# EasyEDA Pro project 小张FOC-STM32G431CBU6.epro, board PCB3
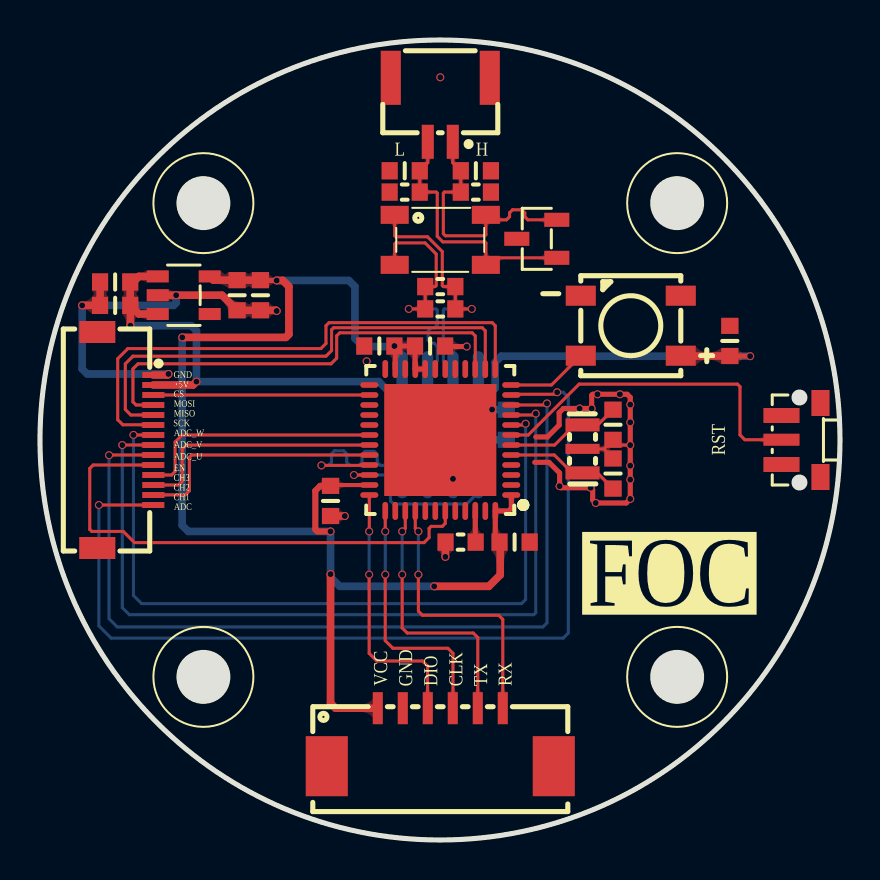
[diagram p7: board, top side]
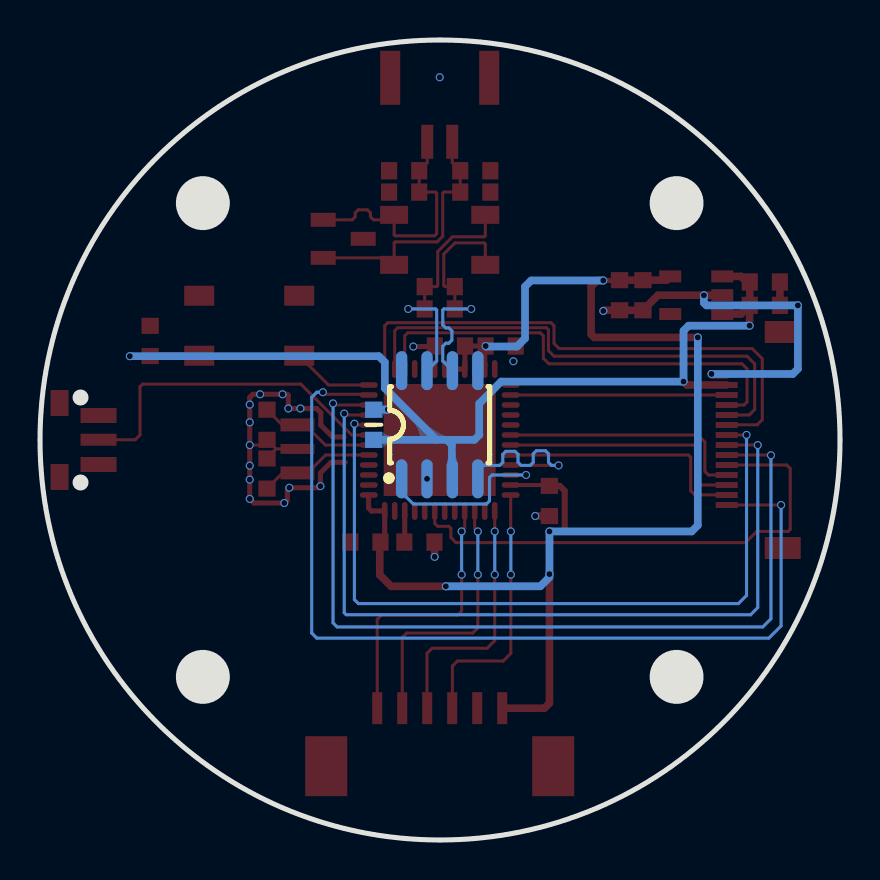
[diagram p8: board, bottom side, seen from below]

Outline 40 x 40 mm; copper layers: Top Layer, Bottom Layer. Coordinates in mm from the lower left corner of the outline.
Outline path: circle c20,20 r20
Stack: Top Layer 0.035mm - / Dielectric1 1.51mm FR4 er 4.5 / Bottom Layer 0.035mm -

## Design rules (mm)
net FDCAN_RX: DP3
net FDCAN_TX: DP3
net FDCAN_H: DP2
net FDCAN_L: DP2
net $1N5235: DP1
net $1N5225: DP1
template: 自定义配置
spacing copperThickness1oz (default): track to track 0.102, other pairs 0.102 to 0.127
spacing copperThickness2oz: track to track 0.203, other pairs 0.152 to 0.3
track width copperThickness1oz (default): min 0.127, default 0.152, max 2.54
track width copperThickness2oz: min 0.203, default 0.254, max 2.54
differential pair differentialPair (default): width min 0.127, default 0.152, max 2.54; gap min 0.152, default 0.152
via viaSize (default): diameter min 0.399, default 0.5, max 10; hole min 0.3, default 0.3, max 6.299

## Placement (name value [footprint] x y rotation side)
C1  100nF  [C0603_SMALL]  23.73 14.89 180 top
C2  100nF  [C0603_SMALL]  16.97 24.7 0 top
C3  100nF  [C0603_SMALL]  14.53 16.95 90 top
C4  100nF  [C0603_SMALL]  19.51 24.7 180 top
C6  20pF  [C0603_SMALL]  28.65 18.32 90 top
C7  20pF  [C0603_SMALL]  28.65 20.76 90 top
C8  100nF  [C0603_SMALL]  34.49 24.95 270 top
C9  100nF  [C0603_SMALL]  23.32 20.76 270 bottom
C10  1uF  [C0603_SMALL]  3.76 27.9 0 top
C11  100nF  [C0603_SMALL]  3.76 26.73 0 top
C12  1uF  [C0603_SMALL]  11.02 27.24 90 top
C13  100nF  [C0603_SMALL]  9.85 27.24 90 top
C14  33pF  [C0603_SMALL]  21.79 33.46 180 top
C15  33pF  [C0603_SMALL]  18.24 33.46 180 top
CN1  1.25-6P WT  [CONN-SMD_1.25-6PWT]  20.01 5.14 180 top
CN2  X1251WRS-02HF-LPSW  [CONN-SMD_2P-P1.25_X1251WRS-02HF-LPSW]  20.01 36.51 180 top
D1  PESD2CAN  [SOT-23-3_L2.9-W1.3-P1.90-LS2.4-BR]  24.84 30.06 0 top
FPC1  FPC-05F-14PH15  [FPC-SMD_14P-P0.50_XUNPU_FPC-05F-14PH15]  4.27 20 270 top
L1  ACT45B-510-2P-TL003  [IND-SMD_4P-L4.5-W3.2-TL]  20.01 30.01 0 top
LED1  XL-5050RGBC-WS2812B  [LED-SMD_4P-L5.0-W5.0-BL_XL-5050RGBC]  29.54 25.72 90 top
R2  62R  [R0603_SMALL]  20.01 26.55 0 top
R3  62R  [R0603_SMALL]  20.01 27.67 0 top
R4  1.5kΩ  [R0603_SMALL]  21.79 32.39 180 top
R5  1.5kΩ  [R0603_SMALL]  18.24 32.39 180 top
R6  10K  [R0603_SMALL]  21.03 14.89 0 top
SW1  SKRTLAE010  [KEY-SMD_SKRTLAE010]  38.05 20 90 top
TP1  M2.5螺丝孔  [X-M2.5螺丝孔]  31.86 31.84 0 top
TP2  M2.5螺丝孔  [X-M2.5螺丝孔]  8.17 8.16 0 top
TP3  M2.5螺丝孔  [X-M2.5螺丝孔]  8.17 31.84 0 top
TP4  M2.5螺丝孔  [X-M2.5螺丝孔]  31.86 8.16 0 top
U1  STM32G431CBU6U  [UFQFPN-48_L7.0-W7.0-P0.50-BL-EP5.6]  20.01 20 90 top
U2  TJA1050T/CM,118  [SOIC-8_L5.0-W4.0-P1.27-LS6.0-BL]  20.01 20.76 180 bottom
U3  RT9013-3.3GB  [SOT-23-5_L2.9-W1.6-P0.94-LS2.8-BL]  7.19 27.24 270 top
X1  8MHz  [OSC-SMD_3P-L3.2-W1.3-P1.2-L]  27.13 19.56 90 top

## Footprints (pads in the part's own frame, mm; a bottom-side part is the same pattern mirrored in y, then rotated)
C0603_SMALL
  rect 0.806x0.864 smd: 1(-0.753,0) 2(0.753,0)
CONN-SMD_1.25-6PWT
  rect 0.5x1.6 smd: 1(3.125,-1.45) 2(1.875,-1.45) 3(0.625,-1.45) 4(-0.625,-1.45) 5(-1.875,-1.45) 6(-3.125,-1.45)
  rect 2.1x3 smd: 7(-5.675,1.45) 8(5.675,1.45)
CONN-SMD_2P-P1.25_X1251WRS-02HF-LPSW
  rect 0.6x1.7 smd: 1(-0.625,1.6) 2(0.625,1.6)
  rect 1x2.7 smd: 3(2.475,-1.6) 4(-2.475,-1.6)
FPC-SMD_14P-P0.50_XUNPU_FPC-05F-14PH15
  rect 0.3x1.1 smd: 1(-3.25,1.4) 2(-2.75,1.4) 3(-2.25,1.4) 4(-1.75,1.4) 5(-1.25,1.4) 6(-0.75,1.4) 7(-0.25,1.4) 8(0.25,1.4) 9(0.75,1.4) 10(1.25,1.4) 11(1.75,1.4) 12(2.25,1.4) 13(2.75,1.4) 14(3.25,1.4)
  rect 1.1x1.8 smd: 15(5.4,-1.4) 16(-5.4,-1.4)
IND-SMD_4P-L4.5-W3.2-TL
  rect 1.4x0.9 smd: 1(-2.28,1.25) 2(-2.28,-1.25) 3(2.28,-1.25) 4(2.28,1.25)
KEY-SMD_SKRTLAE010
  rect 0.75x1.8 smd: 1(-1.225,0.975) 3(1.225,0.975)
  rect 0.6x1.8 smd: 2(0.015,0.975)
  rect 1.3x0.9 smd: 4(-1.85,-0.975) 5(1.85,-0.975)
LED-SMD_4P-L5.0-W5.0-BL_XL-5050RGBC
  rect 1x1.5 smd: 1(-1.5,-2.5) 2(1.5,-2.5) 3(1.5,2.5) 4(-1.5,2.5)
OSC-SMD_3P-L3.2-W1.3-P1.2-L
  rect 0.65x1.7 smd: 1(-1.2,0) 3(1.2,0)
  rect 0.5x1.7 smd: 2(0,0)
R0603_SMALL
  rect 0.806x0.864 smd: 1(-0.753,0) 2(0.753,0)
SOIC-8_L5.0-W4.0-P1.27-LS6.0-BL
  oval 0.569x1.95 smd: 1(-1.905,-2.705) 2(-0.635,-2.705) 3(0.635,-2.705) 4(1.905,-2.705) 5(1.905,2.705) 6(0.635,2.705) 7(-0.635,2.705) 8(-1.905,2.705)
SOT-23-3_L2.9-W1.3-P1.90-LS2.4-BR
  rect 1.25x0.7 smd: 1(1,-0.95) 2(1,0.95) 3(-1,0)
SOT-23-5_L2.9-W1.6-P0.94-LS2.8-BL
  rect 0.6x1.1 smd: 1(-0.94,-1.3) 2(0,-1.3) 3(0.94,-1.3) 4(0.94,1.3) 5(-0.94,1.3)
UFQFPN-48_L7.0-W7.0-P0.50-BL-EP5.6
  oval 0.28x0.9 smd: 1(-2.751,-3.547) 2(-2.251,-3.547) 3(-1.75,-3.547) 4(-1.25,-3.547) 5(-0.75,-3.547) 6(-0.249,-3.547) 7(0.249,-3.547) 8(0.75,-3.547) 9(1.25,-3.547) 10(1.75,-3.547) 11(2.251,-3.547) 12(2.751,-3.547) 25(2.751,3.547) 26(2.251,3.547) 27(1.75,3.547) 28(1.25,3.547) 29(0.75,3.547) 30(0.249,3.547) 31(-0.249,3.547) 32(-0.75,3.547) 33(-1.25,3.547) 34(-1.75,3.547) 35(-2.251,3.547) 36(-2.751,3.547)
  oval 0.9x0.28 smd: 13(3.547,-2.75) 14(3.547,-2.25) 15(3.547,-1.75) 16(3.547,-1.25) 17(3.547,-0.75) 18(3.547,-0.25) 19(3.547,0.25) 20(3.547,0.75) 21(3.547,1.25) 22(3.547,1.75) 23(3.547,2.25) 24(3.547,2.75) 37(-3.547,2.751) 38(-3.547,2.251) 39(-3.547,1.75) 40(-3.547,1.25) 41(-3.547,0.75) 42(-3.547,0.249) 43(-3.547,-0.249) 44(-3.547,-0.75) 45(-3.547,-1.25) 46(-3.547,-1.75) 47(-3.547,-2.251) 48(-3.547,-2.751)
  rect 5.6x5.6 smd: 49(0,0)

## Nets
As in the schematic.

Pads without a net: FPC1 15 16; LED1 2; U1 2 3 4 16 17 18 19 22 24 25 27 28 29 38 41 42 44 45 47; U2 5; U3 4

## Via types
v1: diameter 0.4, hole 0.3, Top Layer to Bottom Layer, 53 vias

## Routing (per net, layer and track width the routed paths; a pad name or vN(x,y) marks a point on that pad's centre or on a via; arc(x,y) is an arc through that point)
+5V: length 54.3
  Top Layer w0.254: v1(35.51,24.19) 34.5,24.19 C8.2
  Top Layer w0.381: 4.52,26.72 C11.2 4.51,27.75 4.94,28.18 U3.1 ; 4.52,26.72 v1(4.52,25.72) ; 4.52,26.72 4.94,26.3 U3.3 ; FPC1.2 7.65,22.75 v1(7.82,22.92) ; C8.2 32.06,24.2 LED1.1
  Bottom Layer w0.381: 20.18,20.01 22.76,22.59 22.76,23.89 23.06,24.19 v1(35.51,24.19) ; 20.18,20.01 19.67,20.01 ; 20.18,20.01 C9.2 ; 19.67,20.01 18.28,20.01 18.03,20.25 18.03,21.83 16.94,22.92 v1(7.82,22.92) 7.82,25.46 7.57,25.72 v1(4.52,25.72) ; 19.67,20.01 19.41,19.75 19.41,18.08 U2.3
GND: length 49.4
  Top Layer w0.152: 28.2,19.56 28.65,19.1 C6.2 ; 28.2,19.56 C7.1 28.91,19.75 v1(29.51,19.75) ; 28.2,19.56 X1.2
  Top Layer w0.254: v1(21.34,24.67) 20.28,24.67 C4.1 ; 24.74,18.88 25.45,18.88 25.98,18.35 v1(25.98,17.69) 26.06,17.61 v1(27.53,17.61) 27.63,17.51 27.63,17 v1(27.79,16.85) 29.31,16.85 v1(29.51,17.05) v1(29.51,18.02) v1(29.51,18.72) v1(29.51,19.75) v1(29.51,20.88) v1(29.51,21.77) 29.51,22.13 29.36,22.29 v1(29,22.29) v1(27.87,22.29) 27.63,22.29 27.58,22.23 v1(27.58,21.58) v1(26.98,21.58) 26.17,21.58 25.96,21.36 25.96,20.74 25.37,20.15 24.79,20.15
  Top Layer w0.381: U3.2 v1(6.81,27.24) 9.1,27.24 C13.1 11.8,26.49 v1(11.84,26.45) ; v1(22.61,21.52) 21.54,21.52 U1.49 ; v1(2.11,26.73) C11.1 3.01,27.75 ; R6.1 20.27,14.89 v1(20.27,14.16) ; v1(6.43,23.3) 6.37,23.25 FPC1.1 ; C3.1 v1(15.24,16.2)
  Bottom Layer w0.381: v1(6.81,27.24) 6.81,26.86 6.68,26.73 v1(2.11,26.73) 2.11,23.56 2.36,23.3 v1(6.43,23.3) ; C9.1 22.61,21.52 v1(22.61,21.52)
  vias: v1(16.33,23.94) v1(20.01,38.14) v1(20.65,18.06)
VCC: length 72
  Top Layer w0.203: U1.35 14.57,17.75 C3.2
  Top Layer w0.254: v1(11.84,27.98) 10.89,27.98 10.87,27.99 ; U1.20 U1.21 18.75,23.56 C4.2 v1(17.72,24.7) 17.76,24.65 U1.23 ; U1.1 23.57,17.24 23.57,16.6 23.43,16.45 U1.48 22.77,14.95 22.82,14.89
  Top Layer w0.305: v1(14.53,15.43) 13.87,15.43 13.77,15.53 13.77,17.46 14.01,17.71 C3.2
  Top Layer w0.381: U3.5 8.67,27.99 C13.2 10.87,27.99 ; v1(19.71,12.69) 22.44,12.69 23.01,13.25 23.01,14.72 22.83,14.89 22.82,14.89 ; CN1.1 14.78,6.59 14.53,6.84 v1(14.53,13.29) ; v1(11.84,27.98) 12.14,27.98 12.45,27.67 12.45,25.28 12.29,25.13 v1(7.11,25.13)
  Bottom Layer w0.381: v1(19.71,12.69) 14.99,12.69 14.53,13.14 v1(14.53,13.29) v1(14.53,15.43) 7.42,15.43 7.11,15.73 v1(7.11,25.13) ; v1(11.84,27.98) 15.44,27.98 15.75,27.67 15.75,25.08 16.15,24.67 17.69,24.67 v1(17.72,24.7)
ADC: length 47.4
  Top Layer w0.152: 2.95,16.75 FPC1.14 ; v1(25.86,22.39) 25.75,22.29 23.6,22.29 U1.11
  Bottom Layer w0.152: v1(2.95,16.75) 2.95,10.7 3.56,10.09 26.16,10.09 26.42,10.35 26.42,22.13 26.16,22.39 v1(25.86,22.39)
ADC_U: length 45.3
  Top Layer w0.152: FPC1.9 3.47,19.25 v1(3.45,19.24) ; U1.10 25.27,21.75 v1(25.35,21.83)
  Bottom Layer w0.152: v1(25.35,21.83) 25.35,10.86 25.15,10.65 3.86,10.65 3.45,11.06 v1(3.45,19.24)
ADC_V: length 41.8
  Top Layer w0.152: v1(24.79,21.32) 24.72,21.25 U1.9 ; FPC1.8 4.12,19.75 v1(4.11,19.75)
  Bottom Layer w0.152: v1(24.79,21.32) 24.79,11.36 24.69,11.26 4.47,11.26 4.11,11.62 v1(4.11,19.75)
ADC_W: length 38.4
  Top Layer w0.152: FPC1.7 4.68,20.25 v1(4.67,20.25) ; v1(24.28,20.81) 24.22,20.75 U1.8
  Bottom Layer w0.152: v1(24.28,20.81) 24.28,12.02 24.08,11.82 5.08,11.82 4.67,12.23 v1(4.67,20.25)
BOOT0: length 1.6
  Top Layer w0.254: R6.2 21.76,14.91 U1.46
FDCAN_H: length 12.7
  Top Layer w0.152: v1(21.59,26.55) 20.77,26.55 R3.2 20.17,27.67 20.12,27.72 20.12,29.42 19.38,30.16 17.79,30.16 17.73,30.21 L1.1
  Bottom Layer w0.152: U2.7 20.17,23.95 20.17,26.5 20.22,26.55 v1(21.59,26.55)
FDCAN_L: length 12.7
  Top Layer w0.152: v1(18.44,26.55) 19.26,26.55 R3.1 19.76,27.67 19.81,27.72 19.81,29.3 19.25,29.86 17.79,29.86 17.73,29.8 L1.2
  Bottom Layer w0.152: 18.44,26.6 v1(18.44,26.55) 19.81,26.55 19.86,26.5 19.86,25.75 19.71,25.6 19.56,25.6 19.41,25.45 19.41,24.99 19.56,24.84 19.71,24.84 19.86,24.69 19.86,23.95 U2.6
FDCAN_RX: length 9.2
  Top Layer w0.152: v1(14.07,18.73) 16.45,18.73 U1.33
  Bottom Layer w0.152: U2.4 18.11,18.6 17.98,18.73 17.01,18.73 16.86,18.88 16.86,19.28 16.71,19.43 16.25,19.43 16.1,19.28 16.1,18.88 15.95,18.73 15.49,18.73 15.34,18.88 15.34,19.31 15.19,19.46 14.73,19.46 14.58,19.31 14.58,18.88 14.42,18.73 v1(14.07,18.73)
FDCAN_TX: length 9.2
  Top Layer w0.152: U1.34 v1(15.7,18.25)
  Bottom Layer w0.152: U2.1 21.92,17.38 21.34,16.8 17.68,16.8 17.53,16.95 17.53,18.12 17.4,18.25 v1(15.7,18.25)
NDRVEN: length 25.6
  Top Layer w0.152: FPC1.10 2.66,18.75 2.49,18.58 2.49,15.53 2.59,15.43 4.16,15.43 4.72,14.87 19.2,14.87 19.46,15.12 19.46,15.58 19.56,15.68 20.12,15.68 20.26,15.83 U1.43
NRST: length 17.1
  Top Layer w0.152: U1.7 24.41,20.25 26.96,22.79 34.87,22.79 35,22.67 35,20.25 35.24,20.01 SW1.2
OSC_IN: length 5.8
  Top Layer w0.152: C6.1 27.87,18.36 X1.1 26.61,18.36 25.72,19.25 U1.5
OSC_OUT: length 5.8
  Top Layer w0.152: C7.2 27.89,20.76 X1.3 26.74,20.76 25.73,19.75 23.57,19.75 U1.6
SPI1_CS: length 10.8
  Top Layer w0.152: FPC1.3 U1.26
SPI1_MISO: length 25.1
  Top Layer w0.152: FPC1.5 4.54,21.25 4.27,21.52 4.27,23.81 4.65,24.19 14.3,24.19 14.58,24.47 14.58,25.51 14.68,25.61 22.11,25.61 22.26,25.46 U1.14
SPI1_MOSI: length 23
  Top Layer w0.152: U1.15 21.76,25.21 21.61,25.36 14.99,25.36 14.83,25.21 14.83,24.09 14.55,23.81 4.9,23.81 4.65,23.56 4.65,21.91 4.8,21.75 FPC1.4
SPI1_SCK: length 27.3
  Top Layer w0.152: U1.13 22.76,25.72 22.61,25.87 14.45,25.87 14.3,25.72 14.3,24.83 14.05,24.57 4.39,24.57 3.89,24.06 3.89,21.02 4.14,20.76 5.65,20.76 FPC1.6
SWCLK: length 12.9
  Top Layer w0.152: U1.37 v1(17.26,15.43) ; CN1.4 20.65,6.6 20.65,9.33 20.4,9.59 17.64,9.59 17.26,9.97 v1(17.26,13.27)
  Bottom Layer w0.152: v1(17.26,15.43) v1(17.26,13.27)
SWDIO: length 13.2
  Top Layer w0.152: U1.36 16.47,15.44 v1(16.46,15.43) ; v1(16.46,13.27) 16.46,9.33 16.84,8.95 19.13,8.95 19.38,8.7 19.38,6.6 CN1.3
  Bottom Layer w0.152: v1(16.46,13.27) v1(16.46,15.43)
TIM1_CH1: length 12.5
  Top Layer w0.152: FPC1.11 6.58,18.25 6.76,18.42 6.76,19.9 7.11,20.25 U1.30
TIM1_CH2: length 12.6
  Top Layer w0.152: FPC1.12 6.94,17.75 7.11,17.92 7.11,19.54 7.31,19.75 16.46,19.75 U1.31
TIM1_CH3: length 12.6
  Top Layer w0.152: U1.32 7.58,19.25 7.47,19.14 7.47,17.46 7.26,17.26 5.67,17.26 FPC1.13
USART3_RX: length 13.9
  Top Layer w0.152: v1(18.92,13.27) 18.92,11.44 19.13,11.24 22.94,11.24 23.14,11.03 CN1.6 ; v1(18.92,15.43) 18.76,15.58 U1.40
  Bottom Layer w0.152: v1(18.92,15.43) v1(18.92,13.27)
USART3_TX: length 13.4
  Top Layer w0.152: v1(18.11,13.27) 18.11,10.6 18.36,10.35 21.67,10.35 21.89,10.12 CN1.5 ; v1(18.11,15.43) 18.26,15.58 U1.39
  Bottom Layer w0.152: v1(18.11,15.43) v1(18.11,13.27)
WS2812: length 4.1
  Top Layer w0.152: LED1.4 25.57,22.75 U1.12
$1N5225: length 13.1
  Top Layer w0.152: CN2.2 19.39,33.86 C15.1 18.99,32.4 19.81,32.4 19.86,32.34 19.86,30.19 20.14,29.91 22.24,29.91 22.29,29.85 L1.3 22.65,29.11 D1.1
$1N5235: length 13.1
  Top Layer w0.152: D1.2 24.39,31.01 24.24,31.16 24.24,31.36 24.09,31.51 23.63,31.51 23.48,31.36 23.48,31.16 23.33,31.01 22.54,31.01 L1.4 22.29,30.26 22.24,30.21 20.27,30.21 20.17,30.31 20.17,32.34 20.22,32.4 R4.2 C14.2 20.64,33.86 CN2.1

## Copper pours and planes (outline as drawn; the poured copper is in the pictures)
GND on Top Layer: 44.03,20.6 43.99,21.53 43.92,22.47 43.81,23.4 43.66,24.33 43.48,25.25 43.26,26.16 43,27.06 42.71,27.95 42.39,28.83 42.03,29.7 41.64,30.55 41.21,31.39 40.75,32.21 40.26,33.01 39.74,33.79 39.19,34.55 38.61,35.28 38,36 37.36,36.68 36.7,37.35 36.01,37.98 35.3,38.59 34.56,39.17 33.8,39.73 33.02,40.25 32.22,40.74 31.4,41.2 30.57,41.62 29.72,42.01 28.85,42.37 27.97,42.7 27.08,42.99 26.17,43.24 25.26,43.46 24.34,43.64 23.41,43.79 22.48,43.9 21.55,43.98 20.61,44.01 19.67,44.01 18.74,43.98 17.8,43.9 16.87,43.79 15.94,43.64 15.02,43.46 14.11,43.24 13.21,42.99 12.31,42.7 11.43,42.37 10.57,42.01 9.72,41.62 8.88,41.2 8.06,40.74 7.26,40.25 6.48,39.73 5.72,39.17 4.99,38.59 4.27,37.98 3.58,37.35 2.92,36.68 2.28,36 1.67,35.28 1.09,34.55 0.54,33.79 0.02,33.01 -0.47,32.21 -0.93,31.39 -1.35,30.55 -1.75,29.7 -2.11,28.83 -2.43,27.95 -2.72,27.06 -2.97,26.16 -3.19,25.25 -3.38,24.33 -3.52,23.4 -3.63,22.47 -3.71,21.53 -3.74,20.6 -3.74,19.66 -3.71,18.72 -3.63,17.79 -3.52,16.85 -3.38,15.93 -3.19,15.01 -2.97,14.09 -2.72,13.19 -2.43,12.3 -2.11,11.42 -1.75,10.55 -1.35,9.7 -0.93,8.87 -0.47,8.05 0.02,7.25 0.54,6.47 1.09,5.71 1.67,4.97 2.28,4.26 2.92,3.57 3.58,2.91 4.27,2.27 4.99,1.66 5.72,1.08 6.48,0.53 7.26,0.01 8.06,-0.48 8.88,-0.94 9.72,-1.37 10.57,-1.76 11.43,-2.12 12.31,-2.44 13.21,-2.73 14.11,-2.99 15.02,-3.21 15.94,-3.39 16.87,-3.54 17.8,-3.65 18.74,-3.72 19.67,-3.76 20.61,-3.76 21.55,-3.72 22.48,-3.65 23.41,-3.54 24.34,-3.39 25.26,-3.21 26.17,-2.99 27.08,-2.73 27.97,-2.44 28.85,-2.12 29.72,-1.76 30.57,-1.37 31.4,-0.94 32.22,-0.48 33.02,0.01 33.8,0.53 34.56,1.08 35.3,1.66 36.01,2.27 36.7,2.91 37.36,3.57 38,4.26 38.61,4.97 39.19,5.71 39.74,6.47 40.26,7.25 40.75,8.05 41.21,8.87 41.64,9.7 42.03,10.55 42.39,11.42 42.71,12.3 43,13.19 43.26,14.09 43.48,15.01 43.66,15.93 43.81,16.85 43.92,17.79 43.99,18.72 44.03,19.66
GND on Bottom Layer: 41.78,20.45 41.74,21.35 41.67,22.25 41.56,23.14 41.41,24.03 41.22,24.91 41,25.78 40.74,26.64 40.45,27.49 40.13,28.33 39.76,29.15 39.37,29.96 38.94,30.75 38.48,31.53 37.99,32.28 37.47,33.01 36.91,33.72 36.33,34.41 35.72,35.07 35.09,35.71 34.42,36.32 33.74,36.9 33.03,37.45 32.29,37.97 31.54,38.47 30.77,38.93 29.98,39.35 29.17,39.75 28.34,40.11 27.51,40.44 26.66,40.73 25.79,40.99 24.92,41.21 24.04,41.39 23.15,41.54 22.26,41.65 21.36,41.73 20.46,41.76 19.56,41.76 18.67,41.73 17.77,41.65 16.88,41.54 15.99,41.39 15.11,41.21 14.24,40.99 13.37,40.73 12.52,40.44 11.68,40.11 10.86,39.75 10.05,39.35 9.26,38.93 8.49,38.47 7.73,37.97 7,37.45 6.29,36.9 5.61,36.32 4.94,35.71 4.31,35.07 3.7,34.41 3.12,33.72 2.56,33.01 2.04,32.28 1.55,31.53 1.09,30.75 0.66,29.96 0.26,29.15 -0.1,28.33 -0.42,27.49 -0.72,26.64 -0.97,25.78 -1.19,24.91 -1.38,24.03 -1.53,23.14 -1.64,22.25 -1.71,21.35 -1.75,20.45 -1.75,19.55 -1.71,18.65 -1.64,17.75 -1.53,16.86 -1.38,15.97 -1.19,15.09 -0.97,14.22 -0.72,13.36 -0.42,12.51 -0.1,11.67 0.26,10.85 0.66,10.04 1.09,9.25 1.55,8.47 2.04,7.72 2.56,6.99 3.12,6.28 3.7,5.59 4.31,4.93 4.94,4.29 5.61,3.68 6.29,3.1 7,2.55 7.73,2.03 8.49,1.53 9.26,1.07 10.05,0.65 10.86,0.25 11.68,-0.11 12.52,-0.44 13.37,-0.73 14.24,-0.99 15.11,-1.21 15.99,-1.39 16.88,-1.54 17.77,-1.65 18.67,-1.73 19.56,-1.76 20.46,-1.76 21.36,-1.73 22.26,-1.65 23.15,-1.54 24.04,-1.39 24.92,-1.21 25.79,-0.99 26.66,-0.73 27.51,-0.44 28.34,-0.11 29.17,0.25 29.98,0.65 30.77,1.07 31.54,1.53 32.29,2.03 33.03,2.55 33.74,3.1 34.42,3.68 35.09,4.29 35.72,4.93 36.33,5.59 36.91,6.28 37.47,6.99 37.99,7.72 38.48,8.47 38.94,9.25 39.37,10.04 39.76,10.85 40.13,11.67 40.45,12.51 40.74,13.36 41,14.22 41.22,15.09 41.41,15.97 41.56,16.86 41.67,17.75 41.74,18.65 41.78,19.55

Small or netless copper shapes (teardrops, artwork), in the pictures only: 182 on Top Layer, 45 on Bottom Layer

## Text on the board
Top Silkscreen Layer: SCK | GND | CS | CH3 | CH2 | CH1 | EN | +5V | MOSI | MISO | ADC_W | ADC_V | ADC_U | ADC | L | H | VCC | DIO | CLK | TX | RX | RST | FOC
